# EAGLE design motorpad (EAGLE 7.1.0)
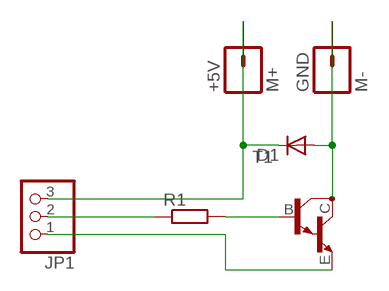
[diagram p0: schematic, sheet 1]

## Parts
+5V  M+  M01OFFSET  [1X01_OFFSET]
D1  DIODESOD  [SOD-323]
GND  M-  M01OFFSET  [1X01_OFFSET]
JP1  PINHD-1X3/90  [1X03/90]
R1  R-EU_R0603  [R0603]
T1  MMBTA13LT1-NPN_DARL-SOT23-BEC  [SOT23-BEC]

## Nets
GND: JP1.1 T1.E
N$1: JP1.2 R1.1
N$2: R1.2 T1.B
N$3: D1.2(A) GND.1 T1.C
N$5: +5V.1 D1.1(C) JP1.3

## Library data of the parts
+5V GND = SparkFun-Connectors:M01: Header 1 Standard 1-pin 0.1" header. Use with straight break away headers (SKU : PRT-00116), right angle break away headers (PRT-00553), swiss pins (PRT-00743), machine pins (PRT-00117), and female headers (PRT-00115).
D1 = SparkFun-DiscreteSemi:DIODE: Diode These are standard reverse protection diodes and small signal diodes. SMA package can handle up to about 1A. SOD-323 can handle about 200mA. What the SOD-323 package when ordering, there are some mfgs out there that are 5-pin packages.
JP1 = pinhead:PINHD-1X3: PIN HEADER
R1 = rcl:R-EU_: RESISTOR, European symbol
T1 = transistor:*-NPN_DARL-: NPN Darlington Transistor

## Board
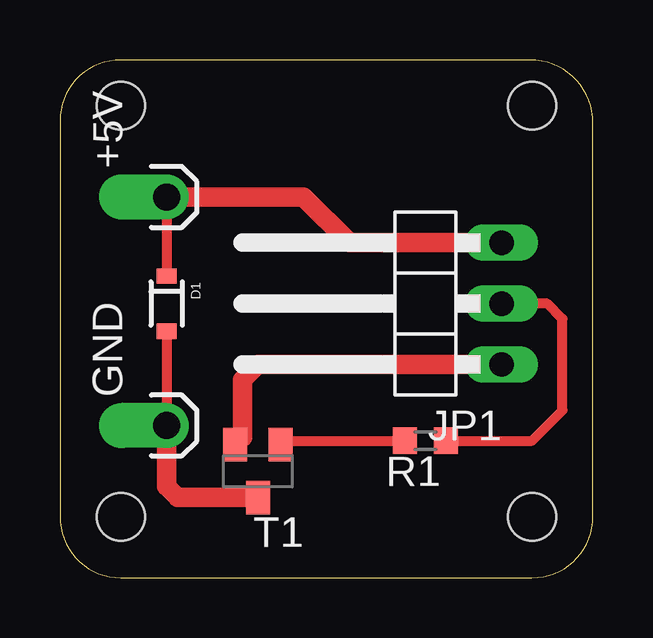
[diagram p1: board, top side]

Size 22.23 x 21.59 mm. Coordinates in mm from the lower left corner, seen from the top.
Outline: 0,19.05 0,2.54 arc90 2.54,0 19.68,0 arc90 22.23,2.54 22.23,18.97 arc90 19.61,21.59 2.54,21.59 arc90 0,19.05
Copper layers (1*16): Top 0.035mm / dielectric 1.5mm / Bottom 0.035mm
Design rules "default": minimum track width 10mil, minimum drill 24mil, track to track 8mil, track to pad 8mil, pad to pad 8mil, via to via 8mil, smd to smd 8mil, copper to edge 40mil, drill to drill 8mil, minimum pad ring 10mil, minimum via ring 8mil, stop-mask expansion 4mil, vias tented up to drill 0mil, thermal gap 10mil
Holes 2 mm at 2.54,2.54 2.54,19.68 19.68,19.68 19.68,2.54

### Footprints (pad centres in the part's own frame; a part is rotated, then mirrored left to right if it is on the bottom)
1X01_OFFSET = drill 1.118 pad 1.88 offset: 1 0,0
SOD-323 = smd 0.63 x 0.83: 1 -1.15,0; 2 1.15,0
1X03/90 = drill 1.016 long: 1 -2.54,-3.81; 2 0,-3.81; 3 2.54,-3.81
R0603 = smd 1 x 1.1: 1 -0.85,0; 2 0.85,0
SOT23-BEC = smd 1 x 1.4: B -0.95,-1.1; C 0,1.1; E 0.95,-1.1

### Placement (x,y rotation side)
+5V  4.45,15.88 90 top
D1  4.45,11.43 270 top
GND  4.45,6.35 90 top
JP1  14.61,11.43 90 top
R1  15.24,5.71 180 top
T1  8.26,4.45 180 top

### Tracks (layer width: path | path; a pad name or v marks a point on that pad's centre or on a via)
GND
  Top 0.406: 7.62,5.86 T1.E
  Top 0.813: JP1.1 8.26,8.89 7.62,8.26 7.62,5.86
N$1
  Top 0.406: R1.1 19.68,5.71 20.95,6.99 20.95,10.79 20.32,11.43 JP1.2
N$2
  Top 0.406: T1.B 9.38,5.71 R1.2
N$3
  Top 0.406: D1.2 GND.1
  Top 0.813: T1.C 4.91,3.35 4.45,3.81 GND.1
N$5
  Top 0.406: +5V.1 D1.1
  Top 0.813: JP1.3 12.06,13.97 10.16,15.88 +5V.1